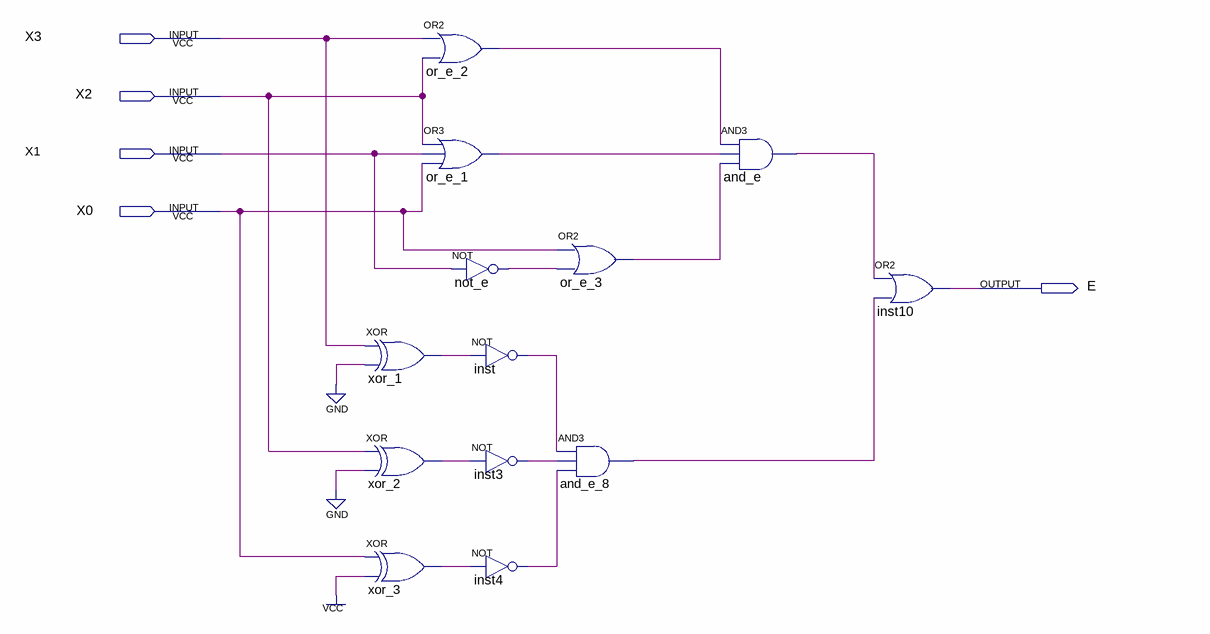
[diagram p0: schematic sheet]
// Quartus schematic dec_segmento_E.bdf as structural Verilog: 13 symbols, 5 pins
module dec_segmento_E (
  input  X3,
  input  X2,
  input  X1,
  input  X0,
  output E
);

  wire and_e_8_out, and_e_out, inst3_out, inst4_out, inst_out, not_e_out, or_e_1_out, or_e_2_out, or_e_3_out,
       xor_1_out, xor_2_out, xor_3_out;

  or or_e_2 (or_e_2_out, X3, X2);
  or or_e_1 (or_e_1_out, X2, X1, X0);
  xor xor_1 (xor_1_out, X3, 1'b0);
  xor xor_2 (xor_2_out, X2, 1'b0);
  xor xor_3 (xor_3_out, X0, 1'b1);
  not not_e (not_e_out, X1);
  not inst (inst_out, xor_1_out);
  not inst3 (inst3_out, xor_2_out);
  not inst4 (inst4_out, xor_3_out);
  or or_e_3 (or_e_3_out, X0, not_e_out);
  and and_e_8 (and_e_8_out, inst_out, inst3_out, inst4_out);
  and and_e (and_e_out, or_e_2_out, or_e_1_out, or_e_3_out);
  or inst10 (E, and_e_out, and_e_8_out);
endmodule
